# Altium schematic sheet display.SchDoc
size A4; SheetNumber: 3; SheetTotal: 5
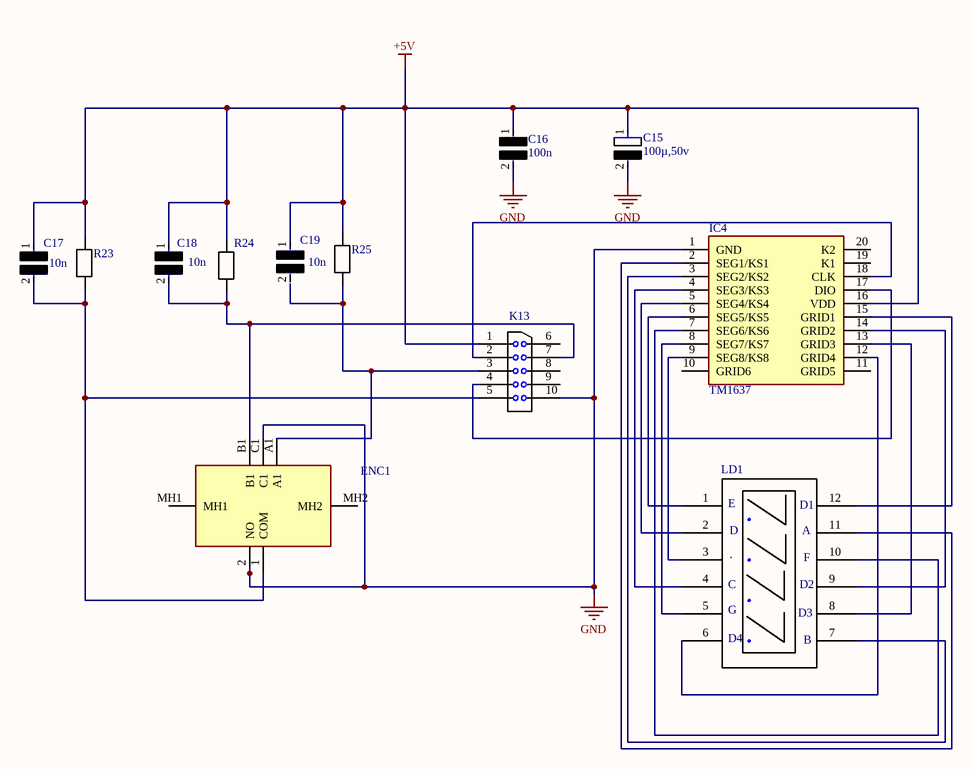
[diagram p0: display.SchDoc]

## Parts
C15  100µ,50v  [RESC2013X50X30LL20T20]
C16  100n  [RESC2013X50X30LL20T20]
C17  10n  [RESC2013X50X30LL20T20]
C18  10n  [RESC2013X50X30LL20T20]
C19  10n  [RESC2013X50X30LL20T20]
ENC1  Switch  [482009514001]  (value not drawn)
IC4  TM1637  [DIP778W53P254L2612H431Q20N]
K13  Pinheader,2rijig,10-polig  [PINHEADER, 2RIJIG,10-POLIG - duplicate - duplicate - duplicate]  (value not drawn)
LD1  7segdisplay  [7SEGDISPALY]  (value not drawn)
R23  weerstand  [RESC2013X50X30LL20T20]  (value not drawn)
R24  weerstand  [RESC2013X50X30LL20T20]  (value not drawn)
R25  weerstand  [RESC2013X50X30LL20T20]  (value not drawn)

## Nets
+5V: C15.1 C16.1 C17.1 C18.1 C19.1 IC4.16(VDD) K13.1 R23.2 R24.2 R25.2
GND: C15.2 C16.2 ENC1.2(NO) ENC1.C1 IC4.1(GND) K13.10
NetC17_2: C17.2 ENC1.1(COM) K13.5 R23.1
NetC18_2: C18.2 ENC1.B1 K13.7 R24.1
NetENC1_A1: ENC1.A1 K13.3 R25.1
NetIC4_2: IC4.2(SEG1/KS1) LD1.11
NetIC4_3: IC4.3(SEG2/KS2) LD1.7
NetIC4_4: IC4.4(SEG3/KS3) LD1.4
NetIC4_5: IC4.5(SEG4/KS4) LD1.2
NetIC4_6: IC4.6(SEG5/KS5) LD1.1
NetIC4_7: IC4.7(SEG6/KS6) LD1.10
NetIC4_8: IC4.8(SEG7/KS7) LD1.5
NetIC4_9: IC4.9(SEG8/KS8) LD1.3
NetIC4_12: IC4.12(GRID4) LD1.6
NetIC4_13: IC4.13(GRID3) LD1.8
NetIC4_14: IC4.14(GRID2) LD1.9
NetIC4_15: IC4.15(GRID1) LD1.12
NetIC4_17: IC4.17(DIO) K13.4
NetIC4_18: IC4.18(CLK) K13.2

Not connected (* = marked no-connect by the designer): C19 2; ENC1 MH1 MH2; IC4 10(GRID6) 11(GRID5) 19(K1) 20(K2); K13 6 8 9

## Notes on the sheet
- (in symbol 7segdisplay) E; D1; D; A; .; F; C; D2; G; D3; D4; B

## Library data of the parts
C15 = Elektrolytische Capacitor: CAP CER 0.1UF 10V X5R 0402; Manufacturer: Kemet; Manufacturer Part Number: C0402C104K8PACTU; Material: Ceramic; Capacitance: 0.10 μF; Temperature Coefficient: 15%; Tolerance: 0.1; Value: 0.10 μF; Package: C0402-BB; Temperature: -55°C to +125°C; ComponentLink2Description: Datasheet; Temperature Characteristic: X5R; Device Class L1: Passive Components; Height: 0.55mm; Lead Free: Yes; ComponentLink2URL: https://content.kemet.com/datasheets/KEM_C1002_X7R_SMD.pdf; Device Class L2: Capacitors; Temperature Range Low: -55°C; Temperature Range High: +125°C; RoHS: TRUE; Octopart: https://octopart.com/c0402c104k8pactu-kemet-140039; Automotive: No; Mouser Description: Capacitor 100 nF 10 VDC 0402 | KEMET C0402C104K8PACTU (Capacitor 100 nF 10 VDC 0402 Ceramic Capacitors).; Category: Cap; Voltage Rating: 10 V; Digikey Description: CAP CER 0.1UF 10V X5R 0402; Ipc Land Pattern Name: CAPC10050X50; Device Class L3: Ceramic Capacitors
C16-C19 = Ceramische Capacitor
ENC1 = Switch: Manufacturer_Name: Wurth Elektronik; Height: 26.6mm; Manufacturer_Part_Number: 482009514001; Mouser Part Number: 710-482009514001; Mouser Price/Stock: https://www.mouser.co.uk/ProductDetail/Wurth-Elektronik/482009514001?qs=2WXlatMagcFsR1YvhlUIOw%3D%3D
IC4 = TM1637: Integrated Circuit; Manufacturer_Name: TITAN MICRO ELECTRONICS; Height: 4.31mm; Manufacturer_Part_Number: TM1637
R23-R25 = weerstand: Manufacturer: Vishay Dale; Part Number: CRCW08050000Z0EA